# Altium schematic sheet mother1-picCapteur.SchDoc
size A4
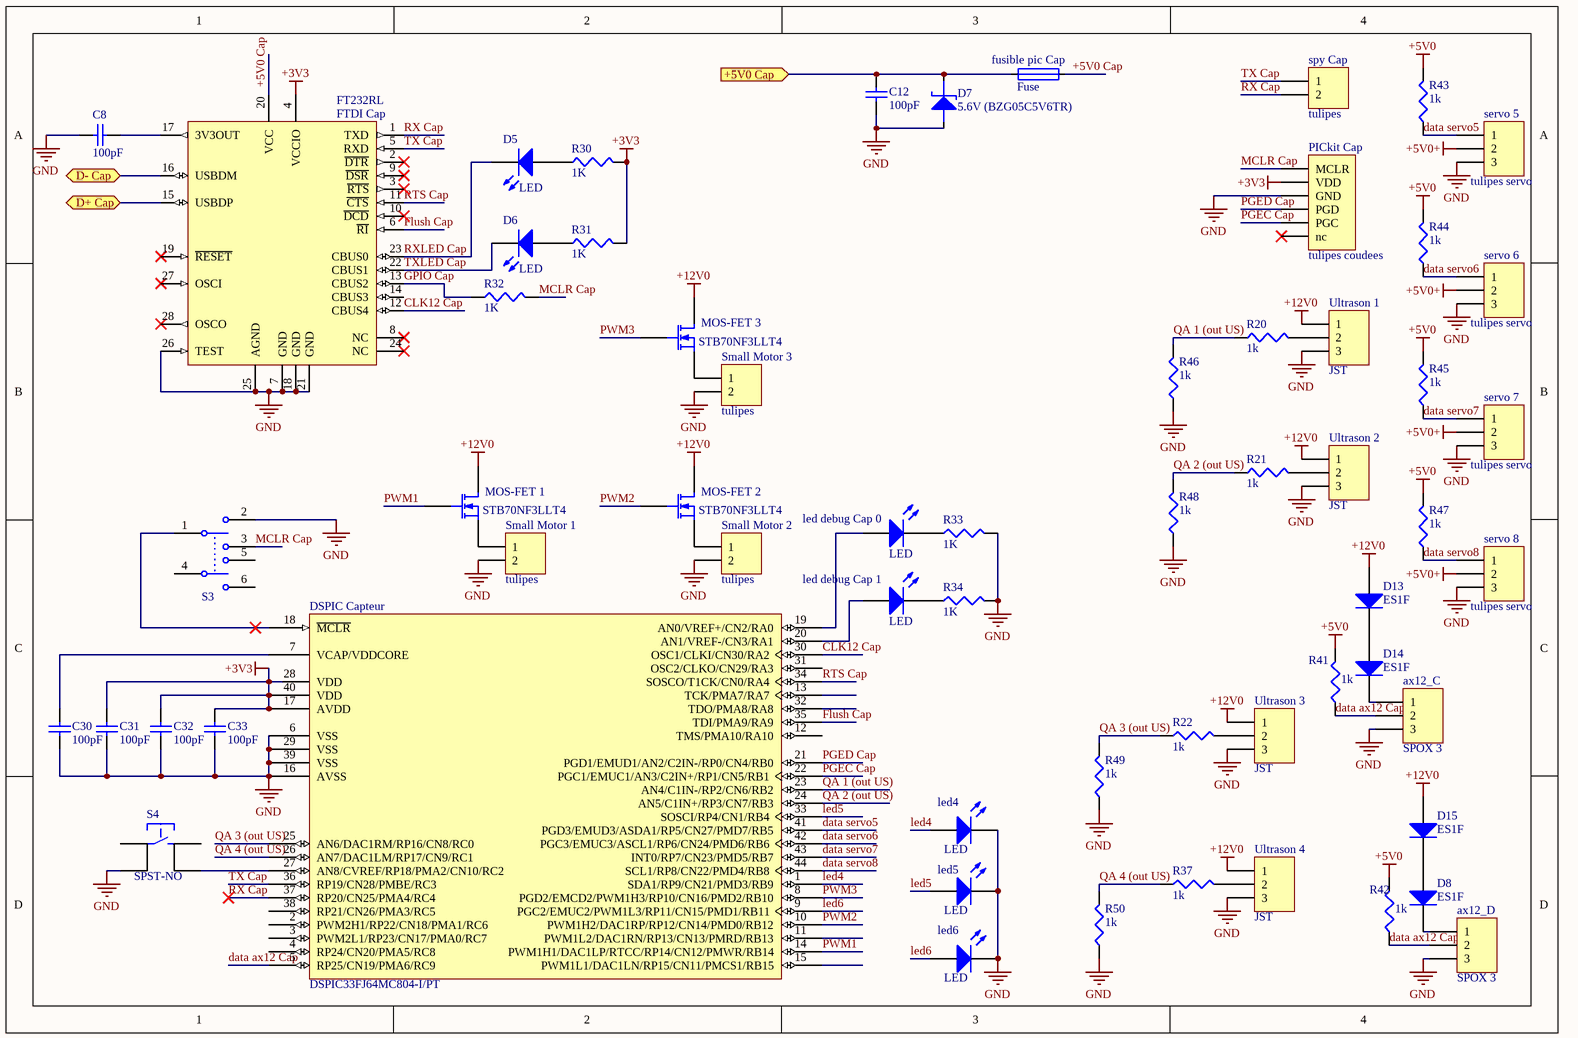
[diagram p0: mother1-picCapteur.SchDoc]

## Parts
ax12_C  SPOX 3  [SPOX 2.5mm (x3)]
ax12_D  SPOX 3  [SPOX 2.5mm (x3)]
C8  value 100pF  [C0805C]  (hidden comment: CAP)
C12  value 100pF  [C0805C]  (hidden comment: CAP)
C30  value 100pF  [C0805C]  (hidden comment: CAP)
C31  value 100pF  [C0805C]  (hidden comment: CAP)
C32  value 100pF  [C0805C]  (hidden comment: CAP)
C33  value 100pF  [C0805C]  (hidden comment: CAP)
D5  LED  [LED1206Y]
D6  LED  [LED1206Y]
D7  5.6V (BZG05C5V6TR)  [DSO-C2/X1.8]
D8  ES1F  [DSO-C2/X1.8]
D13  ES1F  [DSO-C2/X1.8]
D14  ES1F  [DSO-C2/X1.8]
D15  ES1F  [DSO-C2/X1.8]
DSPIC_Capteur  DSPIC33FJ64MC804-I/PT  [TQFP-PT44_N]
FTDI_Cap  FT232RL  [SSOP-28_M]
fusible_pic_Cap  Fuse  [Fuse Holder 5x20mm]
led4  LED  [LED1206G]
led5  LED  [LED1206G]
led6  LED  [LED1206G]
led_debug_Cap_0  LED  [LED1206R]
led_debug_Cap_1  LED  [LED1206R]
MOS-FET_1  STB70NF3LLT4  [D2PAK]
MOS-FET_2  STB70NF3LLT4  [D2PAK]
MOS-FET_3  STB70NF3LLT4  [D2PAK]
PICkit_Cap  tulipes coudees  [HDR1X6H]
R20  value 1k  [C0805R]
R21  value 1k  [C0805R]
R22  value 1k  [C0805R]
R30  value 1K  [C0805R]  (hidden comment: RES)
R31  value 1K  [C0805R]  (hidden comment: RES)
R32  value 1K  [C0805R]  (hidden comment: RES)
R33  value 1K  [C0805R]  (hidden comment: RES)
R34  value 1K  [C0805R]  (hidden comment: RES)
R37  value 1k  [C0805R]
R41  value 1k  [C0805R]
R42  value 1k  [C0805R]
R43  value 1k  [C0805R]
R44  value 1k  [C0805R]
R45  value 1k  [C0805R]
R46  value 1k  [C0805R]
R47  value 1k  [C0805R]
R48  value 1k  [C0805R]
R49  value 1k  [C0805R]
R50  value 1k  [C0805R]
S3  SW-DPDT/Reset  [MCLSS22]  (value not drawn)
S4  SPST-NO  [SPST-NO]
servo_5  tulipes servo  [HDR1X3 - servo]
servo_6  tulipes servo  [HDR1X3 - servo]
servo_7  tulipes servo  [HDR1X3 - servo]
servo_8  tulipes servo  [HDR1X3 - servo]
Small_Motor_1  tulipes  [HDR1X2]
Small_Motor_2  tulipes  [HDR1X2]
Small_Motor_3  tulipes  [HDR1X2]
spy_Cap  tulipes  [HDR1X2]
Ultrason_1  JST  [B3B-PH-K-S]
Ultrason_2  JST  [B3B-PH-K-S]
Ultrason_3  JST  [B3B-PH-K-S]
Ultrason_4  JST  [B3B-PH-K-S]

## Ports
+5V0 Cap (in), D+ Cap (bidir), D- Cap (bidir)

## Nets
+3V3: C31.2 C32.2 C33.2 DSPIC_Capteur.17(AVDD) DSPIC_Capteur.28(VDD) DSPIC_Capteur.40(VDD) FTDI_Cap.4(VCCIO) PICkit_Cap.2(VDD) R30.2 R31.2
+5V0: R41.2 R42.2 R43.2 R44.2 R45.2 R47.2
+5V0+: servo_5.2 servo_6.2 servo_7.2 servo_8.2
+12V0: D13.1(A) D15.1(A) MOS-FET_1.2(D) MOS-FET_2.2(D) MOS-FET_3.2(D) Ultrason_1.1 Ultrason_2.1 Ultrason_3.1 Ultrason_4.1
GND: ax12_C.3 ax12_D.3 C8.2 C12.1 C30.1 C31.1 C32.1 C33.1 D7.1(A) DSPIC_Capteur.6(VSS) DSPIC_Capteur.16(AVSS) DSPIC_Capteur.29(VSS) DSPIC_Capteur.39(VSS) FTDI_Cap.7(GND) FTDI_Cap.18(GND) FTDI_Cap.21(GND) FTDI_Cap.25(AGND) FTDI_Cap.26(TEST) led4.2(K) led5.2(K) led6.2(K) PICkit_Cap.3(GND) R33.2 R34.2 R46.1 R48.1 R49.1 R50.1 S3.2 S4.2 servo_5.3 servo_6.3 servo_7.3 servo_8.3 Small_Motor_1.2 Small_Motor_2.2 Small_Motor_3.2 Ultrason_1.3 Ultrason_2.3 Ultrason_3.3 Ultrason_4.3
+5V0 Cap: FTDI_Cap.20(VCC) fusible_pic_Cap.2
+5V0 Cap: C12.2 D7.2(K) fusible_pic_Cap.1 ; port +5V0 Cap  [a separate net that carries the same name]
CLK12 Cap: DSPIC_Capteur.30(OSC1/CLKI/CN30/RA2) FTDI_Cap.12(CBUS4)
D+ Cap: FTDI_Cap.15(USBDP) ; port D+ Cap
D- Cap: FTDI_Cap.16(USBDM) ; port D- Cap
data ax12 Cap: ax12_C.2 ax12_D.2 DSPIC_Capteur.5(RP25/CN19/PMA6/RC9) R41.1 R42.1
data servo5: DSPIC_Capteur.41(PGD3/EMUD3/ASDA1/RP5/CN27/PMD7/RB5) R43.1 servo_5.1
data servo6: DSPIC_Capteur.42(PGC3/EMUC3/ASCL1/RP6/CN24/PMD6/RB6) R44.1 servo_6.1
data servo7: DSPIC_Capteur.43(INT0/RP7/CN23/PMD5/RB7) R45.1 servo_7.1
data servo8: DSPIC_Capteur.44(SCL1/RP8/CN22/PMD4/RB8) R47.1 servo_8.1
Flush Cap: DSPIC_Capteur.35(TDI/PMA9/RA9) FTDI_Cap.6(~{RI})
GPIO Cap: FTDI_Cap.13(CBUS2) R32.1
led4: DSPIC_Capteur.1(SDA1/RP9/CN21/PMD3/RB9) led4.1(A)
led5: DSPIC_Capteur.33(SOSCI/RP4/CN1/RB4) led5.1(A)
led6: DSPIC_Capteur.9(PGC2/EMUC2/PWM1L3/RP11/CN15/PMD1/RB11) led6.1(A)
MCLR Cap: PICkit_Cap.1(MCLR) R32.2 S3.3
PGEC Cap: DSPIC_Capteur.22(PGC1/EMUC1/AN3/C2IN+/RP1/CN5/RB1) PICkit_Cap.5(PGC)
PGED Cap: DSPIC_Capteur.21(PGD1/EMUD1/AN2/C2IN-/RP0/CN4/RB0) PICkit_Cap.4(PGD)
PWM1: DSPIC_Capteur.14(PWM1H1/DAC1LP/RTCC/RP14/CN12/PMWR/RB14) MOS-FET_1.1(G)
PWM2: DSPIC_Capteur.10(PWM1H2/DAC1RP/RP12/CN14/PMD0/RB12) MOS-FET_2.1(G)
PWM3: DSPIC_Capteur.8(PGD2/EMCD2/PWM1H3/RP10/CN16/PMD2/RB10) MOS-FET_3.1(G)
QA 1 (out US): DSPIC_Capteur.23(AN4/C1IN-/RP2/CN6/RB2) R20.1 R46.2
QA 2 (out US): DSPIC_Capteur.24(AN5/C1IN+/RP3/CN7/RB3) R21.1 R48.2
QA 3 (out US): DSPIC_Capteur.25(AN6/DAC1RM/RP16/CN8/RC0) R22.1 R49.2
QA 4 (out US): DSPIC_Capteur.26(AN7/DAC1LM/RP17/CN9/RC1) R37.1 R50.2
RTS Cap: DSPIC_Capteur.34(SOSCO/T1CK/CN0/RA4) FTDI_Cap.11(~{CTS})
RX Cap: DSPIC_Capteur.37(RP20/CN25/PMA4/RC4) FTDI_Cap.1(TXD) spy_Cap.2
RXLED Cap: D5.2(K) FTDI_Cap.23(CBUS0)
TX Cap: DSPIC_Capteur.36(RP19/CN28/PMBE/RC3) FTDI_Cap.5(RXD) spy_Cap.1
TXLED Cap: D6.2(K) FTDI_Cap.22(CBUS1)
Netax12_C_1: ax12_C.1 D14.2(K)
Netax12_D_1: ax12_D.1 D8.2(K)
NetC8_1: C8.1 FTDI_Cap.17(3V3OUT)
NetC30_2: C30.2 DSPIC_Capteur.7(VCAP/VDDCORE)
NetD5_1: D5.1(A) R30.1
NetD6_1: D6.1(A) R31.1
NetD8_1: D8.1(A) D15.2(K)
NetD13_2: D13.2(K) D14.1(A)
NetDSPIC_Capteur_18: DSPIC_Capteur.18(~{MCLR}) S3.1
NetDSPIC_Capteur_19: DSPIC_Capteur.19(AN0/VREF+/CN2/RA0) led_debug_Cap_0.1(A)
NetDSPIC_Capteur_20: DSPIC_Capteur.20(AN1/VREF-/CN3/RA1) led_debug_Cap_1.1(A)
NetDSPIC_Capteur_27: DSPIC_Capteur.27(AN8/CVREF/RP18/PMA2/CN10/RC2) S4.3
Netled_debug_Cap_0_2: led_debug_Cap_0.2(K) R33.1
Netled_debug_Cap_1_2: led_debug_Cap_1.2(K) R34.1
NetMOS-FET_1_3: MOS-FET_1.3(S) Small_Motor_1.1
NetMOS-FET_2_3: MOS-FET_2.3(S) Small_Motor_2.1
NetMOS-FET_3_3: MOS-FET_3.3(S) Small_Motor_3.1
NetR20_2: R20.2 Ultrason_1.2
NetR21_2: R21.2 Ultrason_2.2
NetR22_2: R22.2 Ultrason_3.2
NetR37_2: R37.2 Ultrason_4.2

Not connected (* = marked no-connect by the designer): DSPIC_Capteur 2(PWM2H1/RP22/CN18/PMA1/RC6) 3(PWM2L1/RP23/CN17/PMA0/RC7) 4(RP24/CN20/PMA5/RC8) 11(PWM1L2/DAC1RN/RP13/CN13/PMRD/RB13) 12(TMS/PMA10/RA10) 13(TCK/PMA7/RA7) 15(PWM1L1/DAC1LN/RP15/CN11/PMCS1/RB15) 31(OSC2/CLKO/CN29/RA3) 32(TDO/PMA8/RA8) 38(RP21/CN26/PMA3/RC5); FTDI_Cap 2(~{DTR})* 3(~{RTS})* 8(NC)* 9(~{DSR})* 10(~{DCD})* 14(CBUS3) 19(~{RESET})* 24(NC)* 27(OSCI)* 28(OSCO)*; PICkit_Cap 6(nc)*; S3 4 5 6; S4 1 4

## Library data of the parts
ax12_C ax12_D servo_5-servo_8 Ultrason_1-Ultrason_4 = Header 3: Header, 3-Pin; LatestRevisionDate: 17-Jul-2002; LatestRevisionNote: Re-released for DXP Platform.; Publisher: Altium Limited
C8 C12 C30-C33 = CAP: Capacitor; Published: 8-Jun-2000; LatestRevisionDate: 29-May-2009; LatestRevisionNote: IPC-7351 Footprint Added.; PackageReference: C1206; Publisher: Altium Limited; PackageDescription: Chip Capacitor
D5 D6 led_debug_Cap_0 led_debug_Cap_1 = LED2: Typical RED, GREEN, YELLOW, AMBER GaAs LED; Published: 8-Jun-2000; LatestRevisionDate: 17-Jul-2002; LatestRevisionNote: Re-released for DXP Platform.; PackageVersion: Feb-2002; PackageReference: 3.2X1.6X1.1; Publisher: Altium Limited; PackageDescription: SM LED; 2 Flat Leads
D7 = ZENER: Zener Diode
D8 D13-D15 = Diode: Pour chute de tension; Published: 8-Jun-2000; LatestRevisionDate: 17-Jul-2002; LatestRevisionNote: Re-released for DXP Platform.; PackageVersion: Sep-1996; PackageReference: SMC; Publisher: Altium Limited; PackageDescription: DO-214-AB/SMC; 2 C-Bend Leads; Body 7.9 x 5.9 mm, inc. leads (LxW); Code_JEDEC: DO-214-AB
DSPIC_Capteur = DSPIC33FJ64MC804-I/PT: High-Performance 16-bit Digital Signal Controller, 64 KB Flash, 16 KB RAM, 44-Pin TQFP, Industrial Temperature; Published: 2-Dec-2009; DatasheetVersion: revD, Nov-2009; PackageVersion: revBB, Aug-2009; PackageReference: TQFP-PT44; Publisher: Altium Limited; PackageDescription: 44-Lead Plastic Thin Quad Flatpack (PT) - 10x10x1mm Body, 2.00mm [TQFP]; Supplier 1: Digi-Key; Supplier Part Number 1: DSPIC33FJ64MC804-I/PT-ND; Supplier 2: Farnell; Supplier Part Number 2: 1576844; Code_JEDEC: MS-026; ComponentLink1Description: Datasheet; ComponentLink1URL: http://ww1.microchip.com/downloads/en/DeviceDoc/70291D.pdf; ComponentLink2Description: Packaging Specification; ComponentLink2URL: http://www.microchip.com/stellent/groups/techpub_sg/documents/packagingspec/en012702.pdf; ComponentLink3Description: Microchip.com Home; ComponentLink3URL: http://www.microchip.com/
FTDI_Cap = FT232RL: USB UART Asynchronous Serial Data Transfer Chip, SSOP-28, Tube; Published: 19-Aug-2010; DatasheetVersion: ver 2.07, Jul-2010; PackageVersion: 2010; PackageReference: SSOP-28; Publisher: Altium Limited; PackageDescription: 28-Pin Small Outline Package 0.65 mm Pitch; ComponentLink1Description: Manufacturer Link; ComponentLink1URL: http://www.ftdichip.com/Products/ICs/FT232R.htm; ComponentLink2Description: Datasheet; ComponentLink2URL: http://www.ftdichip.com/Support/Documents/DataSheets/ICs/DS_FT232R.pdf
led4-led6 = LED: Typical RED, GREEN, YELLOW, AMBER GaAs LED; Published: 8-Jun-2000; LatestRevisionDate: 17-Jul-2002; LatestRevisionNote: Re-released for DXP Platform.; PackageVersion: Feb-2002; PackageReference: 3.2X1.6X1.1; Publisher: Altium Limited; PackageDescription: SM LED; 2 Flat Leads
MOS-FET_1-MOS-FET_3 = IRF640: N-Channel MOSFET, D2PAK (T0-263), InternationalRectifier; Published: 8-Jun-2000; LatestRevisionDate: 17-Jul-2002; LatestRevisionNote: Re-released for DXP Platform.; PackageVersion: 1995/1996; PackageReference: E3; Publisher: Altium Limited; PackageDescription: TO, Flat Index; 3 In-Line, Axial Leads; Body Dia. 4.6mm; Lead Dia. 0.5 mm (max)
PICkit_Cap = Header ICSP: Header, 6-Pin, Right Angle; LatestRevisionDate: 17-Jul-2002; LatestRevisionNote: Re-released for DXP Platform.; Publisher: Altium Limited
R20-R22 R37 R41-R50 = Res3: Resistor; Published: 8-Jun-2000; LatestRevisionDate: 29-May-2009; LatestRevisionNote: IPC-7351 Footprint Added.; PackageReference: J1-0603; Publisher: Altium Limited; PackageDescription: Chip Resistor
R30-R34 = RES: Resistor; Published: 8-Jun-2000; LatestRevisionDate: 29-May-2009; LatestRevisionNote: IPC-7351 Footprint Added.; PackageReference: J1-0603; Publisher: Altium Limited; PackageDescription: Chip Resistor
S3 = SW-DPDT: Double-Pole, Double-Throw Switch, ref MCLSS22; Published: 24-Mar-1999; LatestRevisionDate: 17-Jul-2002; LatestRevisionNote: Re-released for DXP Platform.; PackageReference: DPDT-6; Publisher: Altium Limited; PackageDescription: Switch; 6 Leads
S4 = SPST-NO: Tactile Switch 7.3mm, SMD
Small_Motor_1-Small_Motor_3 spy_Cap = Header 2: Header, 2-Pin; LatestRevisionDate: 17-Jul-2002; LatestRevisionNote: Re-released for DXP Platform.; Publisher: Altium Limited